# Altium schematic sheet Own3V3BUCK.SchDoc: TEAM JX Simon
size 431 x 279 mm; Date: 02/16/2021; ApprovedBy: Chengyang Xi; CheckedBy: Jiahong Ji; Author: Chengyang Xi; CompanyName: UPenn; DrawnBy: Jiahong Ji; Engineer: Chengyang Xi; Organization: UPenn
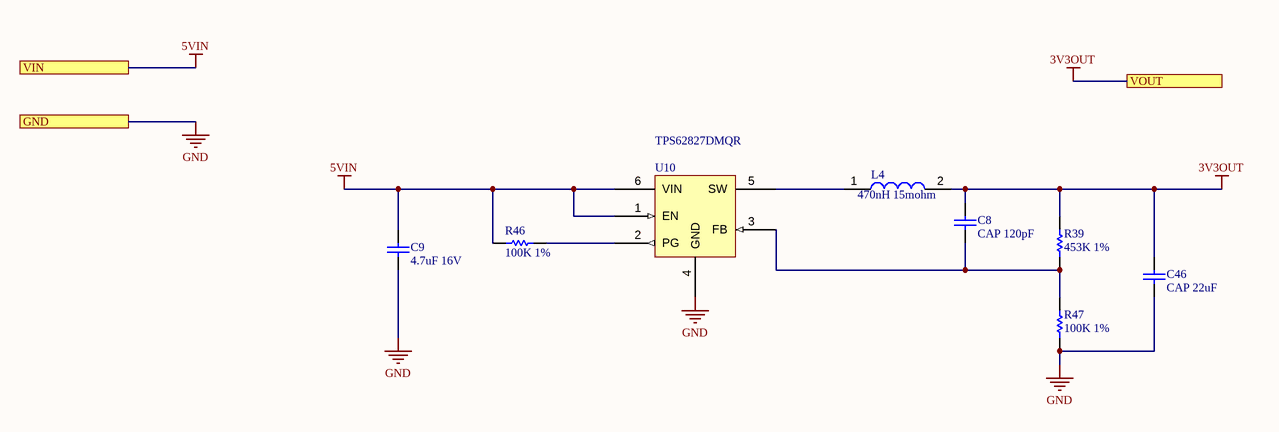
[diagram p0: Own3V3BUCK.SchDoc]

## Parts
C8  CAP 120pF  [CAPC0603(1608)100_N]
C9  4.7uF 16V  [CAPC0805(2012)145_N]
C46  CAP 22uF  [CAPC0805(2012)100_L]
L4  470nH 15mohm  [INDPM3630X150N]
R39  453K 1%  [RESC0603(1608)_N]
R46  100K 1%  [RESC0603(1608)_N]
R47  100K 1%  [RESC0603(1608)_N]
U10  TPS62827DMQR  [TPS62827DMQR]

## Ports
GND, VIN, VOUT

## Nets
3V3OUT: C8.2 C46.2 L4.2 R39.2 ; port VOUT
5VIN: C9.2 R46.1 U10.1(EN) U10.6(VIN) ; port VIN
GND: C9.1 C46.1 R47.1 U10.4(GND) ; port GND
NetC8_1: C8.1 R39.1 R47.2 U10.3(FB)
NetL4_1: L4.1 U10.5(SW)
NetR46_2: R46.2 U10.2(PG)

## Notes on the sheet
- DWG. NO.
- REV.
- SHT.
- THIS DOCUMENT AND THE DATA DISCLOSED HEREIN OR HEREWITH IS THE PROPERTY OF ALTIUM LIMITED AND MAY BE FREELY DISTRIBUTED IN WHOLE. NO RIGHTS ARE RESERVED OR EXPRESS OR IMPLIED WARANTEE GIVEN.
- REVISION
- DESCRIPTION
- DATE
- APPROVED
- ENG:
- APPROVALS
- PROJECT
- DSN:
- CHK:
- REFERENCE DOCUMENTS
- PROJECT REVISION:
- TITLE
- DOCUMENT REVISION:
- DESIGN ITEM:
- BOM:
- FAB DWG:
- PCB DWG:
- ASSY DWG:
- SCALE:
- SIZE
- B
- CAGE CODE
- FILE NAME
- DWG NO.
- SHEET
- OF
- REV

## Library data of the parts
C8 = CMP-1035-01302-1: CAP 120pF 10V ±1% 0603 (1608 Metric) Thickness 1mm SMD; Tolerance: Â±1%; Case-Metric: 1608; Case-EIA: 0603; Rated Voltage: 10 V; Technology: SMT; Max Thickness: 1 mm; Value: 120pF
C9 = CMP-1036-04893-1: CAP 4.7uF 16V -20% to +80% 0805 (2012 Metric) Thickness 1.45mm SMD; Case-Metric: 2012; Case-EIA: 0805; Max Thickness: 1.45 mm; Value: 4.7uF; Rated Voltage: 16 V; Tolerance: -20% to +80%; Technology: SMT
C46 = CMP-1036-04944-1: CAP 22uF 10V ±20% 0805 (2012 Metric) Thickness 1mm SMD; Case-Metric: 2012; Case-EIA: 0805; Tolerance: Â±20%; Technology: SMT; Max Thickness: 1 mm; Value: 22uF; Rated Voltage: 10 V
L4 = IHLP1212AEERR47M11: Inductor Power Shielded Wirewound 470nH 20% 100KHz 6.7A 15mOhm DCR 1212 T/R; Manufacturer_Name: Vishay; Manufacturer: Vishay Dale; Core Material: Ferrite; Self Resonant Frequency: 1MHz; DC Resistance (DCR): 15mR; Datasheet Link: http://www.mouser.com/datasheet/2/427/lp12ae11-244382.pdf; Height: 1.5mm; Manufacturer_Part_Number: IHLP1212AEERR47M11; Mouser Part Number: 70-IHLP1212AEERR47M1; Mouser Price/Stock: https://www.mouser.co.uk/ProductDetail/Vishay-Dale/IHLP1212AEERR47M11/?qs=hVaL6jEgczp7NPonCjkBaw%3D%3D; Arrow Part Number: IHLP1212AEERR47M11; Arrow Price/Stock: https://www.arrow.com/en/products/ihlp1212aeerr47m11/vishay; Supplier 1: Digi-Key; Manufacturer Part Number: IHLP1212AEERR47M11; RoHS: Yes; Category: Fixed Inductors; Stock 1: 46867; Pricing 1: 1=1.26000, 10=1.17000, 25=1.08000, 50=0.90000, 100=0.84600, 250=0.75600, 500=0.64800, 1000=0.57600 (USD); Mount: Surface Mount; Case/Package: 1212; Number of Pins: 2; Min Operating Temperature: -55°C; Max Operating Temperature: 125°C; Packaging: Tape and Reel; Tolerance: 20%; Inductance Tolerance: 20%; Shielding: Shielded; Package Quantity: 3000; Current Rating: 6.7A; Saturation Current: 6.7A; Inductance: 470nH; Max DC Current: 6.7A; Termination: SMD/SMT; Test Frequency: 100kHz; RMS Current (Irms): 6.7A; Series: IHLP-1212AE-11; Rated Current-Max: 6.7A; Length: 3.6mm; Width: 3mm; Height - Seated (Max): 0.059inch; Depth: 3.2mm; Radiation Hardening: No; REACH SVHC: Unknown; Military Standard: Not; Lead Free: Lead Free; RoHS Compliant: Yes; ComponentLink1URL: https://datasheet.ciiva.com/3081/lp12ae11-3081904.pdf?src-supplier=Avnet; ComponentLink1Description: https://datasheet.ciiva.com/3081/lp12ae11-3081904.pdf?src-supplier=Avnet; ComponentLink2URL: https://datasheet.ciiva.com/3081/lp12ae11-3081905.pdf?src-supplier=Avnet; ComponentLink2Description: https://datasheet.ciiva.com/3081/lp12ae11-3081905.pdf?src-supplier=Avnet; ComponentLink3URL: https://datasheet.ciiva.com/28651/1836116-28651335.pdf?src-supplier=Element14; ComponentLink3Description: https://datasheet.ciiva.com/28651/1836116-28651335.pdf?src-supplier=Element14; ComponentLink4URL: https://datasheet.ciiva.com/6692/ihlp-1212ae-11-6692009.pdf?src-supplier=Digi-Key; ComponentLink4Description: https://datasheet.ciiva.com/6692/ihlp-1212ae-11-6692009.pdf?src-supplier=Digi-Key; ComponentLink5URL: https://datasheet.ciiva.com/6692/ihlp-1212ae-11-6692010.pdf?src-supplier=Digi-Key; ComponentLink5Description: https://datasheet.ciiva.com/6692/ihlp-1212ae-11-6692010.pdf?src-supplier=Digi-Key; ComponentLink6URL: https://datasheet.ciiva.com/6692/ihlp-1212ae-11-6692011.pdf?src-supplier=Digi-Key; ComponentLink6Description: https://datasheet.ciiva.com/6692/ihlp-1212ae-11-6692011.pdf?src-supplier=Digi-Key; ComponentLink7URL: https://datasheet.ciiva.com/7649/lp12ae11-7649723.pdf?src-supplier=Element14; ComponentLink7Description: https://datasheet.ciiva.com/7649/lp12ae11-7649723.pdf?src-supplier=Element14; Supplier Part Number 1: 541-1330-1-ND
R39 = CMP-1012-00810-1: 453K 0.1W 1% 0603 (1608 Metric)  SMD; Case-Metric: 1608; Value: 453000.00 Ohm; Case-EIA: 0603; Tolerance: 1 %; Power: 0.1 W; Technology: SMT
R46 R47 = CMP-1012-00736-1: 100K 0.1W 1% 0603 (1608 Metric)  SMD; Value: 100000.00 Ohm; Case-Metric: 1608; Case-EIA: 0603; Power: 0.1 W; Tolerance: 1 %; Technology: SMT
U10 = TPS62827DMQR: 2.4V-5.5V input, 4A step-down converter with 1% Accuracy in 1.5mm x 1.5mm QFN 6-VSON-HR -40 to 125; Manufacturer: Texas Instruments; Supplier 1: Digi-Key; Manufacturer Part Number: TPS62827DMQR; RoHS: Yes; Category: Voltage Regulators - Switching; Pricing 1: 1=1.93000, 10=1.73000, 25=1.63240, 100=1.30590, 250=1.14268, 500=1.11004, 1000=0.88150 (USD); RoHS Compliant: Yes; Supplier Part Number 1: 296-TPS62827DMQRCT-ND